# EAGLE schematic batterietest (EAGLE 9.6.2)
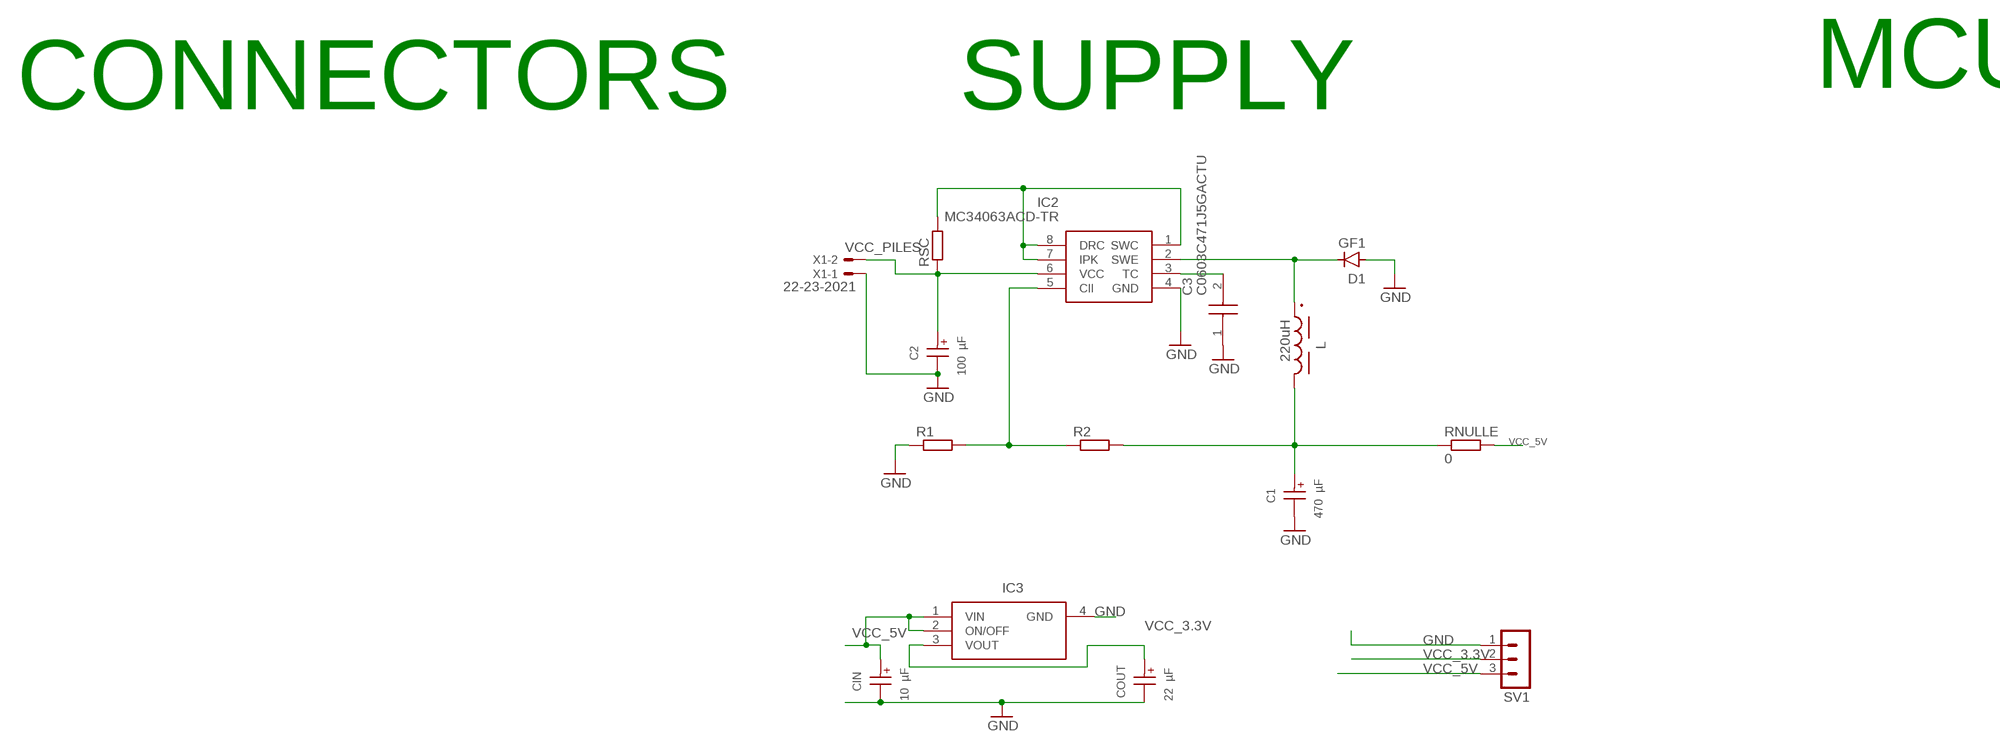
[diagram p0: schematic, sheet 1]

## Parts
C1  470 µF  WCAP-ASLL_8X10.5_865060353009  [WCAP-ASLL_8X10.5(DXL)]
C2  100 µF  WCAP-ASLL_6.3X7.7_865060445005  [WCAP-ASLL_6.3X7.7(DXL)]
C3  C0603C471J5GACTU  [C0603]
CIN  10 µF  WCAP-ASLL_4X5.5_865060440001  [WCAP-ASLL_4X5.5(DXL)]
COUT  22 µF  WCAP-ASLL_5X5.5_865060442002  [WCAP-ASLL_5X5.5(DXL)]
D1  GF1  [SMA-DO214AC]
IC2  MC34063ACD-TR  [SOIC127P600X175-8N]
IC3  NCV33375ST3.3T3G  [SOT230P700X175-4N]
L  220uH  WE-PDA_1260_784771221  [WE-PDA_1260]
R1  R-EU_R0603  [R0603]
R2  R-EU_R0603  [R0603]
RNULLE  0  R-EU_R0603  [R0603]
RSC  R-EU_R1206W  [R1206W]
SV1  MA03-1  [MA03-1]
X1  22-23-2021  [22-23-2021]

## Nets
GND: C1.2(-) C2.2(-) C3.1 CIN.2(-) COUT.2(-) D1.A IC2.4(GND) IC3.4(GND) R1.1 SV1.1 X1.1
N$1: C1.1(+) L.2 R2.2 RNULLE.1
N$2: IC2.1(SWC) IC2.7(IPK) IC2.8(DRC) RSC.2
N$3: IC2.5(CII) R1.2 R2.1
N$6: D1.K(C) IC2.2(SWE) L.1
N$7: C3.2 IC2.3(TC)
VCC_3.3V: COUT.1(+) IC3.3(VOUT) SV1.2
VCC_5V: CIN.1(+) IC3.1(VIN) IC3.2(ON/OFF) RNULLE.2 SV1.3
VCC_PILES: C2.1(+) IC2.6(VCC) RSC.1 X1.2

## Notes on the sheet
- CONNECTORS | SUPPLY | MCU

## Library data of the parts
C1 = C1:WCAP-ASLL_8X10.5: WCAP-ASLL Aluminium Electrolytic Capacitors Low Impedance & Long Life +105 °C Characteristics Low impedance and long life product series Mounting style: V-Chip SMT Capacitance range: 1 µF ‒ 6800 µF Capacitance tolerance: ±20 % Voltage range (UR): 6.3 ‒ 450 V(DC) Operating temperature: -55 °C up to +105 °C for UR ≤ 100 V(DC) -40 °C up to +105 °C for UR > 100 V(DC) Endurance: 2000 ‒ 5000 h @ +105 °C Dimensions (DxL) in mm: 4.0 x 5.5 up to 16.0 x 17.0 Recommended soldering: Reflow soldering Applications Long life application & low impedance Input and output capacitor for switched-mode power supply Filtering Smoothing e.g. DC/DC converter, AC/DC converter, satellite receiver, control panel <https://www.we-online.com/catalog/media/o14724v209%20Family_WCAP-ASLL.jpg> Details see: https://www.we-online.com/catalog/en/WCAP-ASLL/ Updated by yingchun,Shan;2020-03-03 2020(C) Würth Elektronik; DATASHEET-URL: https://www.we-online.com/catalog/datasheet/865060353009.pdf; DF: 16%; DIAMETER: 8mm; I-LEAK: 75.2uA; I-RIPPLE: 600mA; L: 10.5mm; OPERATING-TEMPERATURE: -55 °C up to +105 °C; PART-NUMBER: 865060353009; TECHNICAL-REFERENCE: ASEE105471M016DVCTEE000; VR: 16V(DC); Z: 0.17Ohm
C2 = C2:WCAP-ASLL_6.3X7.7: WCAP-ASLL Aluminium Electrolytic Capacitors Low Impedance & Long Life +105 °C Characteristics Low impedance and long life product series Mounting style: V-Chip SMT Capacitance range: 1 µF ‒ 6800 µF Capacitance tolerance: ±20 % Voltage range (UR): 6.3 ‒ 450 V(DC) Operating temperature: -55 °C up to +105 °C for UR ≤ 100 V(DC) -40 °C up to +105 °C for UR > 100 V(DC) Endurance: 2000 ‒ 5000 h @ +105 °C Dimensions (DxL) in mm: 4.0 x 5.5 up to 16.0 x 17.0 Recommended soldering: Reflow soldering Applications Long life application & low impedance Input and output capacitor for switched-mode power supply Filtering Smoothing e.g. DC/DC converter, AC/DC converter, satellite receiver, control panel <https://www.we-online.com/catalog/media/o14724v209%20Family_WCAP-ASLL.jpg> Details see: https://www.we-online.com/catalog/en/WCAP-ASLL/ Updated by yingchun,Shan;2020-03-03 2020(C) Würth Elektronik; DATASHEET-URL: https://www.we-online.com/catalog/datasheet/865060445005.pdf; DF: 14%; DIAMETER: 6.3mm; I-LEAK: 25uA; I-RIPPLE: 300mA; L: 7.7mm; OPERATING-TEMPERATURE: -55 °C up to +105 °C; PART-NUMBER: 865060445005; TECHNICAL-REFERENCE: ASED077101M025DVCTCB000; VR: 25V(DC); Z: 0.36Ohm
C3 = C0603C471J5GACTU:C0603C471J5GACTU: SMD Comm C0G, Ceramic, 470 pF, 5%, 50 VDC, 125 VDC, 125?C, -55?C, C0G, SMD, MLCC, Ultra-Stable, Low Loss, Class I, 0.1 % , 100 GOhms, 3.7 mg, 0603, 1.6mm, 0.8mm, 0.8mm, 0.7mm, 0.35mm, 4000, 78 Weeks, 120 Source: Datasheet <https://content.kemet.com/datasheets/KEM_C1003_C0G_SMD.pdf>; ARROW_PART_NUMBER: C0603C471J5GACTU; ARROW_PRICE-STOCK: https://www.arrow.com/en/products/c0603c471j5gactu/kemet-corporation?region=nac; DESCRIPTION: SMD Comm C0G, Ceramic, 470 pF, 5%, 50 VDC, 125 VDC, 125?C, -55?C, C0G, SMD, MLCC, Ultra-Stable, Low Loss, Class I, 0.1 % , 100 GOhms, 3.7 mg, 0603, 1.6mm, 0.8mm, 0.8mm, 0.7mm, 0.35mm, 4000, 78 Weeks, 120; HEIGHT: 0.87mm; MANUFACTURER_NAME: KEMET; MANUFACTURER_PART_NUMBER: C0603C471J5GACTU; MOUSER_PART_NUMBER: 80-C0603C471J5G; MOUSER_PRICE-STOCK: https://www.mouser.co.uk/ProductDetail/KEMET/C0603C471J5GACTU?qs=6Zy9Yzz7FWCvDjERNKhvPg%3D%3D
CIN = Cin:WCAP-ASLL_4X5.5: WCAP-ASLL Aluminium Electrolytic Capacitors Low Impedance & Long Life +105 °C Characteristics Low impedance and long life product series Mounting style: V-Chip SMT Capacitance range: 1 µF ‒ 6800 µF Capacitance tolerance: ±20 % Voltage range (UR): 6.3 ‒ 450 V(DC) Operating temperature: -55 °C up to +105 °C for UR ≤ 100 V(DC) -40 °C up to +105 °C for UR > 100 V(DC) Endurance: 2000 ‒ 5000 h @ +105 °C Dimensions (DxL) in mm: 4.0 x 5.5 up to 16.0 x 17.0 Recommended soldering: Reflow soldering Applications Long life application & low impedance Input and output capacitor for switched-mode power supply Filtering Smoothing e.g. DC/DC converter, AC/DC converter, satellite receiver, control panel <https://www.we-online.com/catalog/media/o14724v209%20Family_WCAP-ASLL.jpg> Details see: https://www.we-online.com/catalog/en/WCAP-ASLL/ Updated by yingchun,Shan;2020-03-03 2020(C) Würth Elektronik; DATASHEET-URL: https://www.we-online.com/catalog/datasheet/865060440001.pdf; DF: 14%; DIAMETER: 4mm; I-LEAK: 3uA; I-RIPPLE: 90mA; L: 5.5mm; OPERATING-TEMPERATURE: -55 °C up to +105 °C; PART-NUMBER: 865060440001; TECHNICAL-REFERENCE: ASEB055100M025DVCTAB000; VR: 25V(DC); Z: 1.35Ohm
COUT = Cout:WCAP-ASLL_5X5.5: WCAP-ASLL Aluminium Electrolytic Capacitors Low Impedance & Long Life +105 °C Characteristics Low impedance and long life product series Mounting style: V-Chip SMT Capacitance range: 1 µF ‒ 6800 µF Capacitance tolerance: ±20 % Voltage range (UR): 6.3 ‒ 450 V(DC) Operating temperature: -55 °C up to +105 °C for UR ≤ 100 V(DC) -40 °C up to +105 °C for UR > 100 V(DC) Endurance: 2000 ‒ 5000 h @ +105 °C Dimensions (DxL) in mm: 4.0 x 5.5 up to 16.0 x 17.0 Recommended soldering: Reflow soldering Applications Long life application & low impedance Input and output capacitor for switched-mode power supply Filtering Smoothing e.g. DC/DC converter, AC/DC converter, satellite receiver, control panel <https://www.we-online.com/catalog/media/o14724v209%20Family_WCAP-ASLL.jpg> Details see: https://www.we-online.com/catalog/en/WCAP-ASLL/ Updated by yingchun,Shan;2020-03-03 2020(C) Würth Elektronik; DATASHEET-URL: https://www.we-online.com/catalog/datasheet/865060442002.pdf; DF: 14%; DIAMETER: 5mm; I-LEAK: 5.5uA; I-RIPPLE: 150mA; L: 5.5mm; OPERATING-TEMPERATURE: -55 °C up to +105 °C; PART-NUMBER: 865060442002; TECHNICAL-REFERENCE: ASEC055220M025DVCTBB000; VR: 25V(DC); Z: 0.8Ohm
D1 = diode:GF1: DIODE
IC2 = SamacSys_Parts:MC34063ACD-TR: MC34063ACD-TR, DC-DC Controller, 40 V, 8-Pin, SOIC Source: Datasheet <http://www.st.com/st-web-ui/static/active/en/resource/technical/document/datasheet/CD00001232.pdf>; DESCRIPTION: MC34063ACD-TR, DC-DC Controller, 40 V, 8-Pin, SOIC; HEIGHT: 1.75mm; MANUFACTURER_NAME: STMicroelectronics; MANUFACTURER_PART_NUMBER: MC34063ACD-TR; MOUSER_PART_NUMBER: 511-MC34063ACD-TR; MOUSER_PRICE-STOCK: https://www.mouser.co.uk/ProductDetail/STMicroelectronics/MC34063ACD-TR?qs=zDcCjb1ShEnlEhOFqqejBw%3D%3D
IC3 = SamacSys_Parts:NCV33375ST3.3T3G: ON SEMICONDUCTOR - NCV33375ST3.3T3G - Fixed LDO Voltage Regulator, 4.3V to 13V, 260mV Dropout, 3.3Vout, 300mAout, SOT-223-4 Source: Datasheet <http://www.onsemi.com/pub/Collateral/MC33375-D.PDF>; DESCRIPTION: ON SEMICONDUCTOR - NCV33375ST3.3T3G - Fixed LDO Voltage Regulator, 4.3V to 13V, 260mV Dropout, 3.3Vout, 300mAout, SOT-223-4; HEIGHT: 1.75mm; MANUFACTURER_NAME: onsemi; MANUFACTURER_PART_NUMBER: NCV33375ST3.3T3G; MOUSER_PART_NUMBER: 863-NCV33375ST3.3T3G; MOUSER_PRICE-STOCK: https://www.mouser.co.uk/ProductDetail/ON-Semiconductor/NCV33375ST33T3G?qs=Pqj8oIac8rWOl%252BM3OwXrOg%3D%3D
L = L:WE-PDA_1260: WE-PDA SMD Shielded Power Inductor Characteristics Magnetically shielded version which results in a low leakage field High storage capacity High Saturation currents up to 23 A Very low self-losses at high switching frequency's Wide inductance spectrum available at all sizes Operating Temperature -40 °C up to +125 °C Core Material: NiZn Wire connection: welding technology Applications Multimedia applications Switching regulators with low operating voltages Integrated DC/DC-converter Perfect suitable for switching regulators with extremely high efficiency (> 86 %) Plastic base: Because of the one piece construction these are more suitable for high vibration or shock applications <https://www.we-online.com/catalog/media/o55118v209%20Family_WE-PDA.jpg> Details see: https://www.we-online.com/katalog/en/WE-PDA Updated by Ella Wu 2020-03-18 2020(C) Wurth Elektronik; DATASHEET-URL: https://www.we-online.com/catalog/datasheet/784771221.pdf; FRES: 3.9MHz; IR: 0.99A; ISAT: 1.1A; MOUNT: SMT; PART-NUMBER: 784771221; RDC-MAX: 348mOhm; RDC-TYP: 290mOhm
R1 R2 RNULLE RSC = rcl:R-EU_: RESISTOR, European symbol; SPICEPREFIX: R
SV1 = con-lstb:MA03-1: PIN HEADER; OC_FARNELL: unknown; OC_NEWARK: unknown
X1 = con-molex:22-23-2021: .100" (2.54mm) Center Header - 2 Pin; MF: MOLEX; MPN: 22-23-2021; OC_FARNELL: 1462926; OC_NEWARK: 25C3832